# Altium project PCB_Project1.PrjPCB
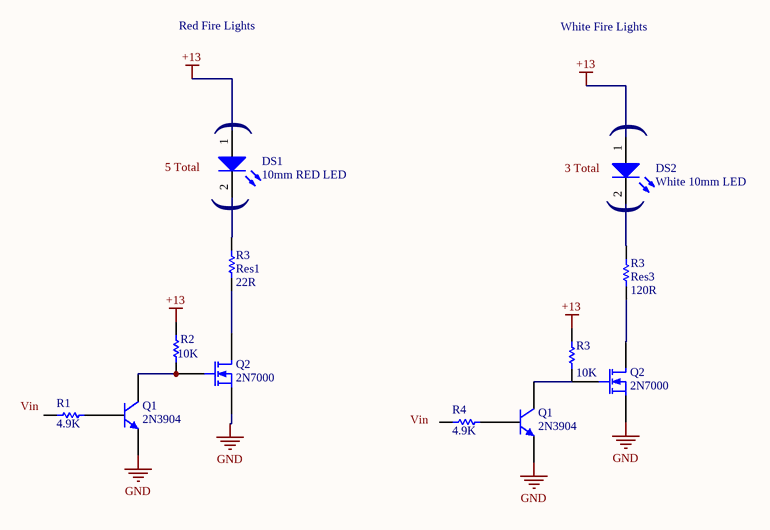
[diagram p0: Fire LED.SchDoc]
3 sheets, 21 parts. Net scope: global (net labels, ports and power ports of the same name join across sheets).
Sheets:
  Fire LED.SchDoc
  Pot.SchDoc
  a.SchDoc

## Sheet Fire LED.SchDoc
size A; Organization: Smart Product Design Lab; Address1: 201 Thornton; Address2: Stanford University; Address3: Stanford, CA; Address4: 94305-4021

### Parts
(Parts that share a designator on the sheet are numbered #1, #2 ... from top to bottom, then left to right.)
DS1#1  10mm RED LED  [LED-1]
DS2  White 10mm LED  [LED-1]
Q1#1  2N3904  [BCY-W3/D4.7]
Q1#2  2N3904  [BCY-W3/D4.7]
Q2#1  2N7000  [BCY-W3/D5]
Q2#2  2N7000  [BCY-W3/D5]
R1#1  value 4.9K  [AXIAL-0.3]  (hidden comment: Res1)
R2  value 10K  [AXIAL-0.3]  (hidden comment: Res1)
R3#1  Res1  value 22R  [AXIAL-0.3]
R3#2  Res3  value 120R  [AXIAL-0.3]
R3#3  value 10K  [AXIAL-0.3]  (hidden comment: Res1)
R4  value 4.9K  [AXIAL-0.3]  (hidden comment: Res1)

### Nets
+13: DS1#1.1(A) DS2.1(A) R2.2 R3#3.2
GND: Q1#1.1(E) Q1#2.1(E) Q2#1.1(S)
NetDS1#1_2: DS1#1.2(K) R3#1.2
NetDS2_2: DS2.2(K) R3#2.2
NetQ1#1_2: Q1#1.2(B) R1#1.1
NetQ1#1_3: Q1#1.3(C) Q2#1.2(G) R2.1
NetQ1#2_2: Q1#2.2(B) R4.1
NetQ1#2_3: Q1#2.3(C) Q2#2.2(G)
NetQ2#1_3: Q2#1.3(D) R3#1.1
NetQ2#2_3: Q2#2.3(D) R3#2.1

Not connected (* = marked no-connect by the designer): Q2#2 1(S); R1#1 2; R3#3 1; R4 2

### Notes on the sheet
- Red Fire Lights
- White Fire Lights
- (near DS1#1) (
- (near DS2) (
- Labels drawn without touching a wire or pin: 3 Total, 5 Total, GND, Vin
- Title
- Size:
- Date:
- File:
- A
- Number:
- Time:
- Revision:
- Sheet
- of
- Drawn By:

### Library data of the parts
DS1#1 DS2 = LED1: Typical RED GaAs LED; Manufacturer: Generic Components; Class: Optoelectronic; Published: 08/06/2000; Publisher: Altium Hobart Technology Centre; SubClass: LED
Q1#1 Q1#2 = 2N3904: NPN General Purpose Amplifier; Manufacturer: Generic Components; Revised: 11-July-2000: SIM Model Added.; Class: Discrete; SubClass: BJT - Low Power; Published: 08/06/2000; Publisher: Altium Hobart Technology Centre
Q2#1 Q2#2 = 2N7000: N-Channel Enhancement Mode Vertical DMOS FET; Manufacturer: Zetex; Class: Discrete; SubClass: MOSFET - Low Power; Published: 8/06/2000; Publisher: Altium Hobart Technology Centre
R1#1 R2 R3#1-R3#3 R4 = Res1: Resistor; Manufacturer: Generic Components; Class: Passive; Published: 08/06/2000; Publisher: Altium Hobart Technology Centre; SubClass: Resistor

## Sheet Pot.SchDoc
size A; Organization: Smart Product Design Lab; Address1: 201 Thornton; Address2: Stanford University; Address3: Stanford, CA; Address4: 94305-4021
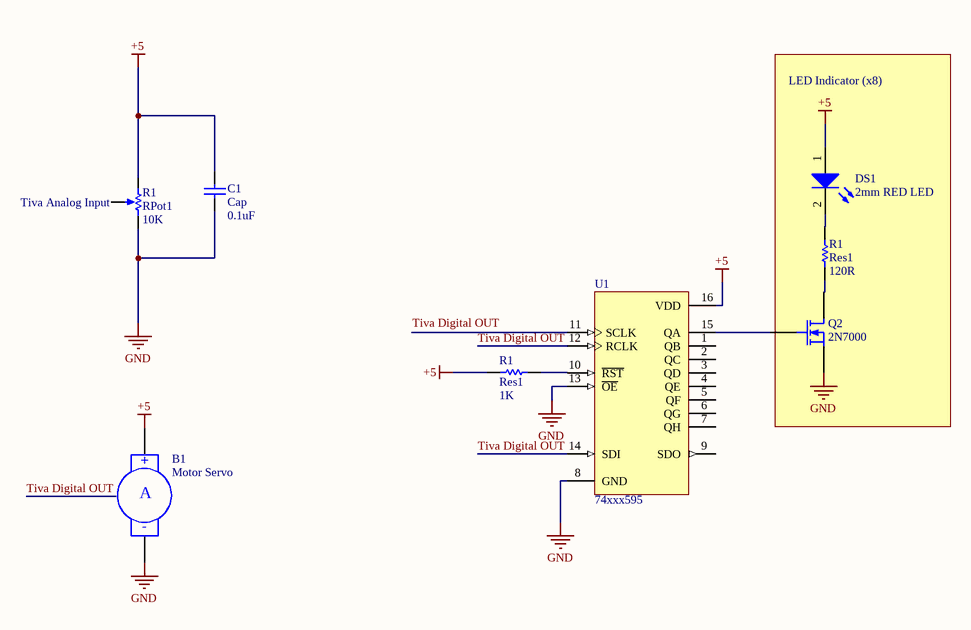
[diagram p1: Pot.SchDoc]

### Parts
(Parts that share a designator on the sheet are numbered #1, #2 ... from top to bottom, then left to right.)
B1  Motor Servo  [RAD-0.4]
C1  Cap  value 0.1uF  [RAD-0.3]
DS1#2  2mm RED LED  [LED-1]
Q2#3  2N7000  [BCY-W3/D5]
R1#2  RPot1  value 10K  [VR5]
R1#3  Res1  value 120R  [AXIAL-0.3]
R1#4  Res1  value 1K  [AXIAL-0.3]
U1  74xxx595  [DIP-16/X1.5]

### Blocks framed on the sheet
LED Indicator (x8): DS1#2 Q2#3 R1#3

### Nets
+5: B1.1(+) C1.2 DS1#2.1(A) R1#2.1(TOP) R1#4.1 U1.16(VDD)
GND: B1.2(-) C1.1 Q2#3.1(S) R1#2.2(BOT) U1.8(GND) U1.13(~{OE})
Tiva Digital OUT: U1.12(RCLK) U1.14(SDI)
NetDS1#2_2: DS1#2.2(K) R1#3.2
NetQ2#3_2: Q2#3.2(G) U1.15(QA)
NetQ2#3_3: Q2#3.3(D) R1#3.1
NetR1#4_2: R1#4.2 U1.10(~{RST})

Not connected (* = marked no-connect by the designer): R1#2 3(TAP); U1 1(QB) 2(QC) 3(QD) 4(QE) 5(QF) 6(QG) 7(QH) 9(SDO) 11(SCLK)

### Notes on the sheet
- (near R1#2) Tiva Analog Input
- Labels drawn without touching a wire or pin: Tiva Digital OUT
- Title
- Size:
- Date:
- File:
- A
- Number:
- Time:
- Revision:
- Sheet
- of
- Drawn By:
- (in symbol Motor Servo) A

### Library data of the parts
B1 = Motor Servo: Servo Motor; Manufacturer: Generic Components; Published: 1999
C1 = Cap: Capacitor; Manufacturer: Generic Components; Class: Passive; Published: 08/06/2000; Publisher: Altium Hobart Technology Centre; SubClass: Capacitor
DS1#2 = LED1: as DS1#1 on sheet Fire LED; Published: 08/06/2000; Publisher: Altium Hobart Technology Centre; SubClass: LED
Q2#3 = 2N7000: as Q2#1 on sheet Fire LED; Published: 8/06/2000; Publisher: Altium Hobart Technology Centre
R1#2 = RPot1: Potentiometer; Manufacturer: Generic Components; Class: Passive; Set Position: 0.5; Published: 08/06/2000; Publisher: Altium Hobart Technology Centre; SubClass: Potentiometer
R1#3 R1#4 = Res1: as R1#1 on sheet Fire LED; Published: 08/06/2000; Publisher: Altium Hobart Technology Centre; SubClass: Resistor
U1 = 74xxx595: 8-Bit Serial-Input/Serial or Prallel-Output Shift Register with Latched 3-State Outputs; Manufacturer: ON Semiconductor; Class: Logic; Published: 15/04/2002; Publisher: Altium Hobart Technology Centre; SubClass: Register

## Sheet a.SchDoc
size A; Organization: Smart Product Design Lab; Address1: 201 Thornton; Address2: Stanford University; Address3: Stanford, CA; Address4: 94305-4021
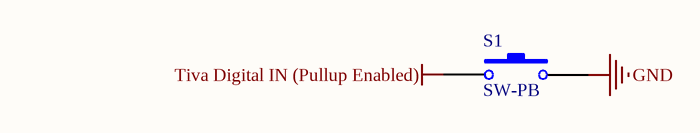
[diagram p2: a.SchDoc]

### Parts
S1  SW-PB  [SPST-2]

### Nets
GND: S1.2
Tiva Digital IN (Pullup Enabled): S1.1

### Notes on the sheet
- Title
- Size:
- Date:
- File:
- A
- Number:
- Time:
- Revision:
- Sheet
- of
- Drawn By:

### Library data of the parts
S1 = SW-PB: Switch; Manufacturer: Generic Components; Published: 1999

## Nets that join several sheets
GND: Fire LED (Q1#1.1 Q1#2.1 Q2#1.1), Pot (6 pins), a (S1.2)